# Altium schematic sheet obc-v2_MCU-POWER.SchDoc
size 420 x 297 mm; SheetNumber: 22; SheetTotal: 23
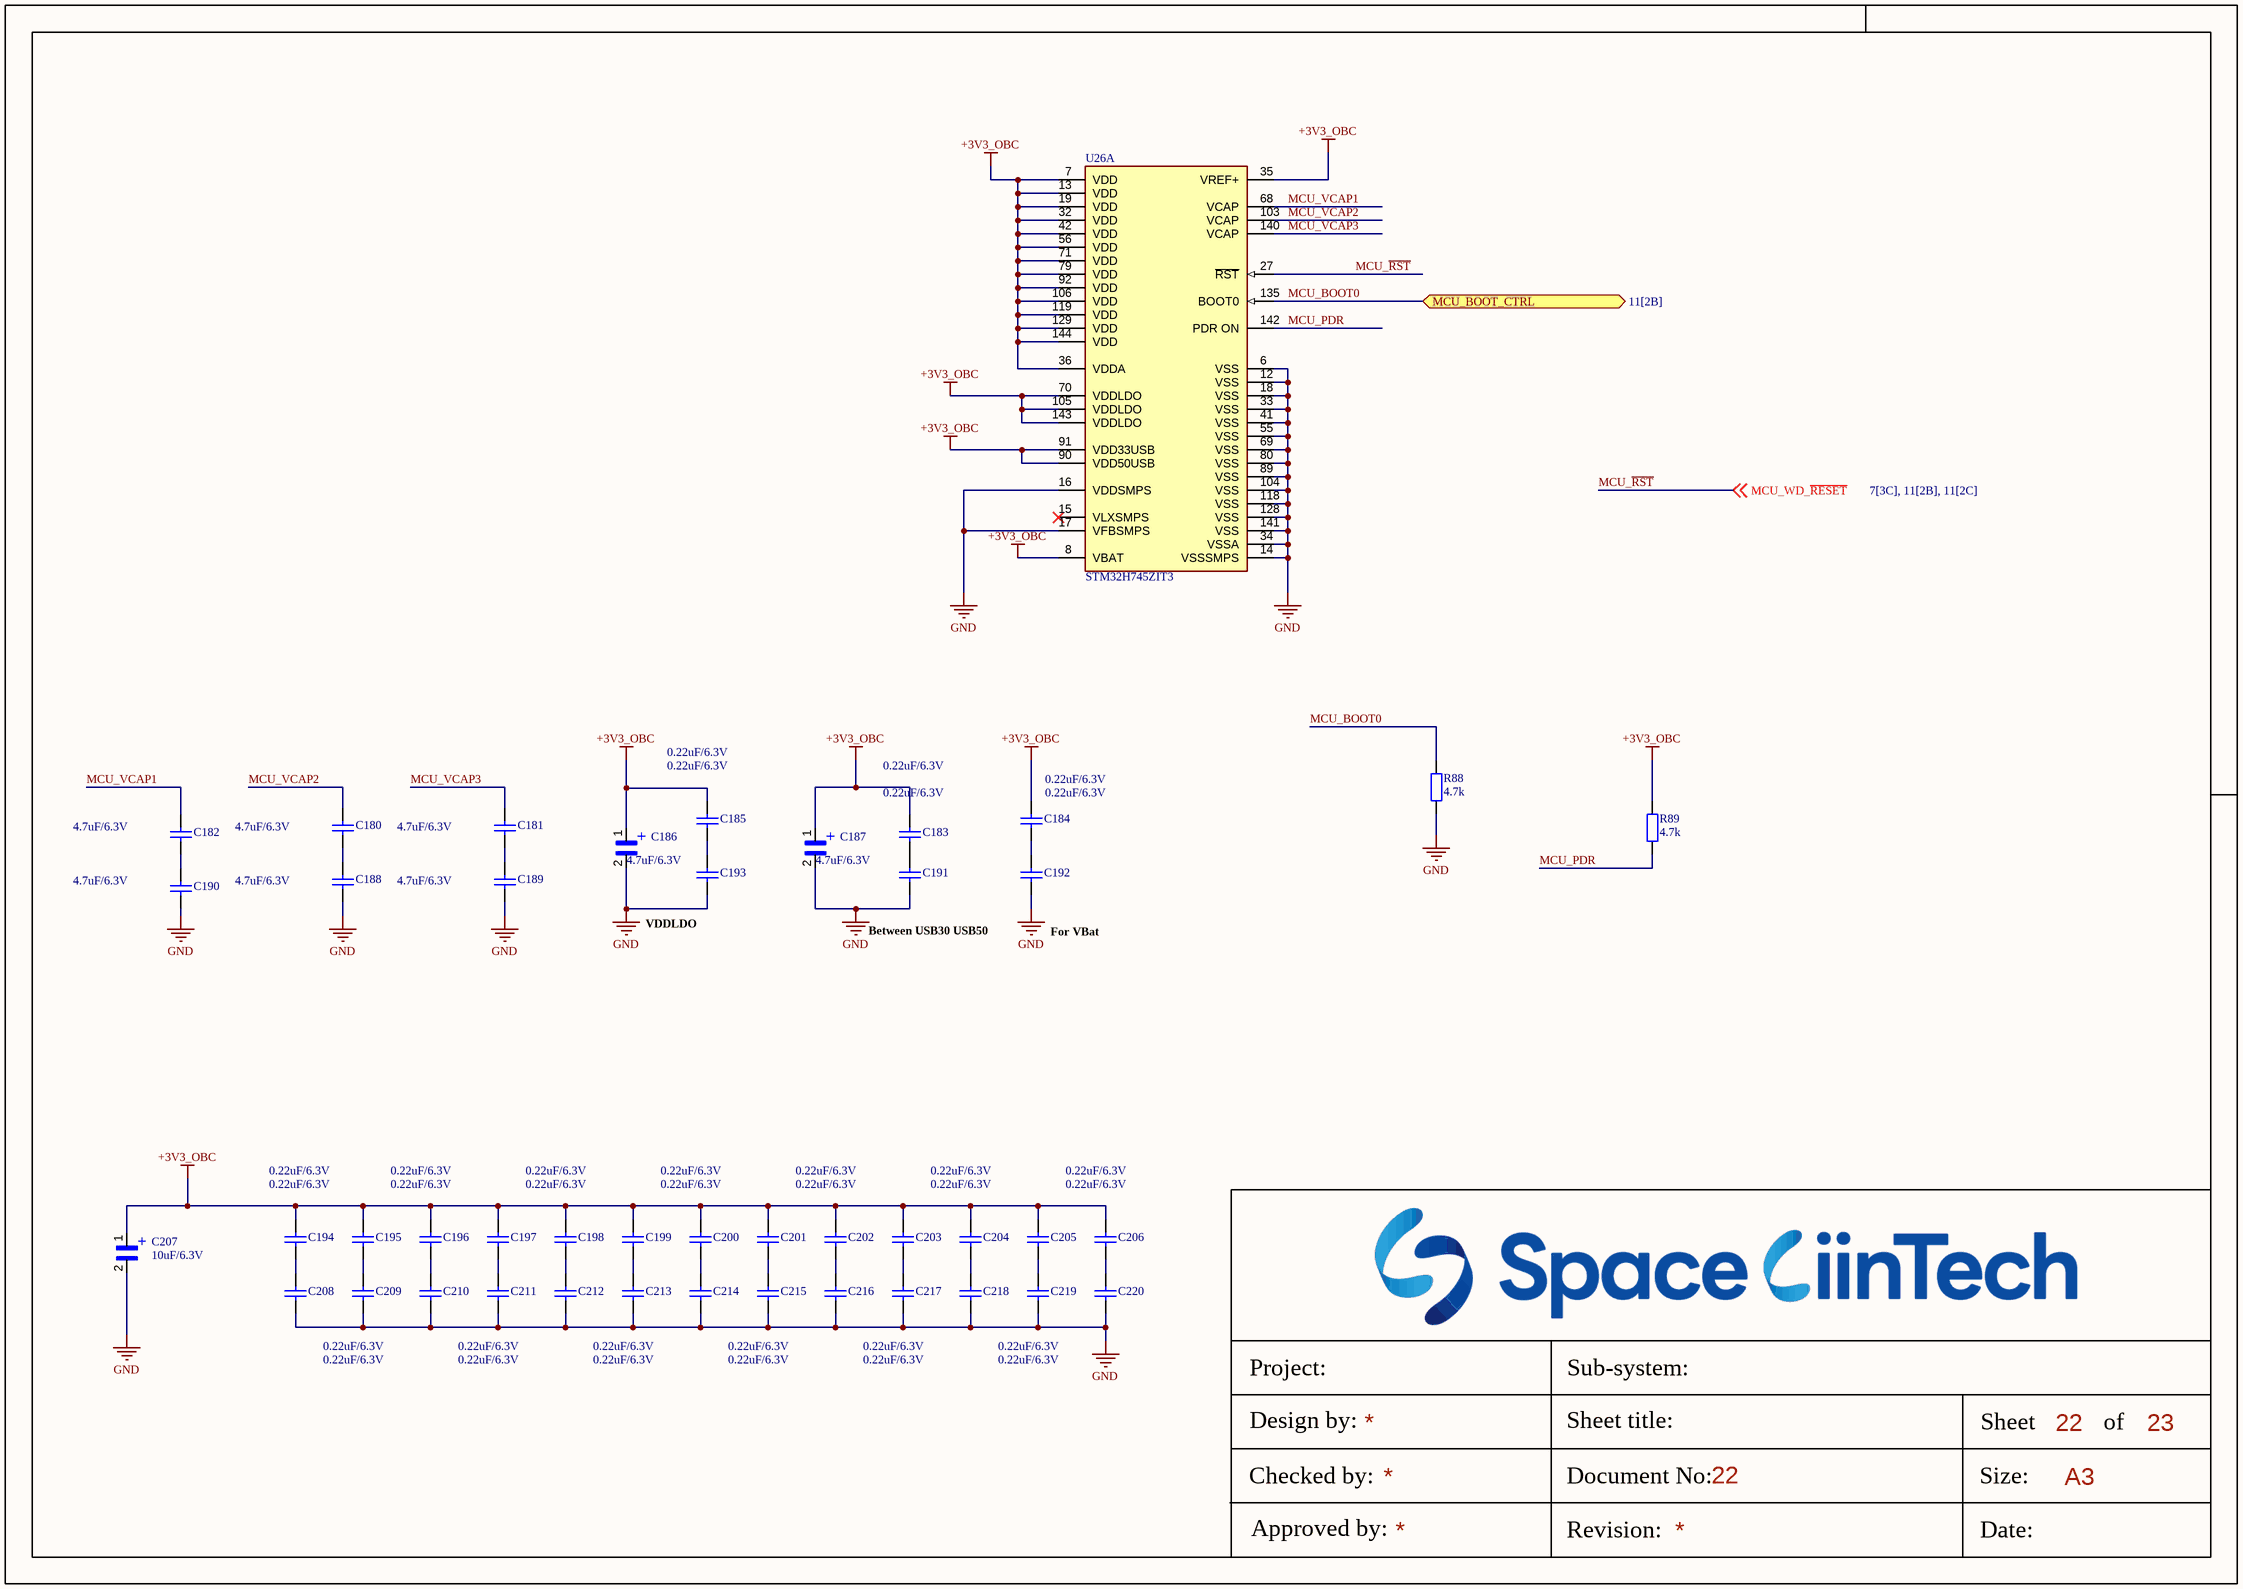
[diagram p0: obc-v2_MCU-POWER.SchDoc]

## Parts
C180  4.7uF/6.3V  [CAP_C_1005X60]
C181  4.7uF/6.3V  [CAP_C_1005X60]
C182  4.7uF/6.3V  [CAP_C_1005X60]
C183  0.22uF/6.3V  [CAP_C_1005X60]
C184  0.22uF/6.3V  [CAP_C_1005X60]
C185  0.22uF/6.3V  [CAP_C_1005X60]
C186  4.7uF/6.3V  [CAP_MP_1608X90]
C187  4.7uF/6.3V  [CAP_MP_1608X90]
C188  4.7uF/6.3V  [CAP_C_1005X60]
C189  4.7uF/6.3V  [CAP_C_1005X60]
C190  4.7uF/6.3V  [CAP_C_1005X60]
C191  0.22uF/6.3V  [CAP_C_1005X60]
C192  0.22uF/6.3V  [CAP_C_1005X60]
C193  0.22uF/6.3V  [CAP_C_1005X60]
C194  0.22uF/6.3V  [CAP_C_1005X60]
C195  0.22uF/6.3V  [CAP_C_1005X60]
C196  0.22uF/6.3V  [CAP_C_1005X60]
C197  0.22uF/6.3V  [CAP_C_1005X60]
C198  0.22uF/6.3V  [CAP_C_1005X60]
C199  0.22uF/6.3V  [CAP_C_1005X60]
C200  0.22uF/6.3V  [CAP_C_1005X60]
C201  0.22uF/6.3V  [CAP_C_1005X60]
C202  0.22uF/6.3V  [CAP_C_1005X60]
C203  0.22uF/6.3V  [CAP_C_1005X60]
C204  0.22uF/6.3V  [CAP_C_1005X60]
C205  0.22uF/6.3V  [CAP_C_1005X60]
C206  0.22uF/6.3V  [CAP_C_1005X60]
C207  10uF/6.3V  [CAP_MP_2012X170]
C208  0.22uF/6.3V  [CAP_C_1005X60]
C209  0.22uF/6.3V  [CAP_C_1005X60]
C210  0.22uF/6.3V  [CAP_C_1005X60]
C211  0.22uF/6.3V  [CAP_C_1005X60]
C212  0.22uF/6.3V  [CAP_C_1005X60]
C213  0.22uF/6.3V  [CAP_C_1005X60]
C214  0.22uF/6.3V  [CAP_C_1005X60]
C215  0.22uF/6.3V  [CAP_C_1005X60]
C216  0.22uF/6.3V  [CAP_C_1005X60]
C217  0.22uF/6.3V  [CAP_C_1005X60]
C218  0.22uF/6.3V  [CAP_C_1005X60]
C219  0.22uF/6.3V  [CAP_C_1005X60]
C220  0.22uF/6.3V  [CAP_C_1005X60]
R88  4.7k  [RES_C_1608X60]
R89  4.7k  [RES_C_1608X60]
U26  STM32H745ZIT3  [FP-LQFP144-1A-MFG]  (part A of 3)

## Ports
MCU_BOOT_CTRL (bidir, see 11[2B])

## Nets
+3V3_OBC: C183.1 C184.1 C185.1 C186.1 C187.1 C194.1 C195.1 C196.1 C197.1 C198.1 C199.1 C200.1 C201.1 C202.1 C203.1 C204.1 C205.1 C206.1 C207.1 R89.1 U26.7(VDD) U26.8(VBAT) U26.13(VDD) U26.19(VDD) U26.32(VDD) U26.35(VREF+) U26.36(VDDA) U26.42(VDD) U26.56(VDD) U26.70(VDDLDO) U26.71(VDD) U26.79(VDD) U26.90(VDD50USB) U26.91(VDD33USB) U26.92(VDD) U26.105(VDDLDO) U26.106(VDD) U26.119(VDD) U26.129(VDD) U26.143(VDDLDO) U26.144(VDD)
GND: C186.2 C187.2 C188.2 C189.2 C190.2 C191.2 C192.2 C193.2 C207.2 C208.2 C209.2 C210.2 C211.2 C212.2 C213.2 C214.2 C215.2 C216.2 C217.2 C218.2 C219.2 C220.2 R88.1 U26.6(VSS) U26.12(VSS) U26.14(VSSSMPS) U26.16(VDDSMPS) U26.17(VFBSMPS) U26.18(VSS) U26.33(VSS) U26.34(VSSA) U26.41(VSS) U26.55(VSS) U26.69(VSS) U26.80(VSS) U26.89(VSS) U26.104(VSS) U26.118(VSS) U26.128(VSS) U26.141(VSS)
MCU_BOOT0: R88.2 U26.135(BOOT0) ; port MCU_BOOT_CTRL
MCU_PDR: R89.2 U26.142(PDR_ON)
MCU_~{RST}: U26.27(~{RST}) ; off-sheet MCU_WD_~{RESET}  [also labelled MCU_WD_~{RESET}]
MCU_VCAP1: C182.1 U26.68(VCAP)
MCU_VCAP2: C180.1 U26.103(VCAP)
MCU_VCAP3: C181.1 U26.140(VCAP)
NetC180_2: C180.2 C188.1
NetC181_2: C181.2 C189.1
NetC182_2: C182.2 C190.1
NetC183_2: C183.2 C191.1
NetC184_2: C184.2 C192.1
NetC185_2: C185.2 C193.1
NetC194_2: C194.2 C208.1
NetC195_2: C195.2 C209.1
NetC196_2: C196.2 C210.1
NetC197_2: C197.2 C211.1
NetC198_2: C198.2 C212.1
NetC199_2: C199.2 C213.1
NetC200_2: C200.2 C214.1
NetC201_2: C201.2 C215.1
NetC202_2: C202.2 C216.1
NetC203_2: C203.2 C217.1
NetC204_2: C204.2 C218.1
NetC205_2: C205.2 C219.1
NetC206_2: C206.2 C220.1

Not connected (* = marked no-connect by the designer): U26 15(VLXSMPS)*

## Notes on the sheet
- VDDLDO
- Between USB30 USB50
- (near C192) For VBat
- Project:
- Sub-system:
- Design by:
- Sheet title:
- Sheet
- A3
- of
- Checked by:
- Approved by:
- Revision:
- Document No:
- Size:
- Date:
- (in symbol TACL335M003RTA) +
- (in symbol TACR686M003RTA) +

## Library data of the parts
C180-C182 C185 C188-C190 C193 = Tu 0402 33nF 10V: 4.7 µF ±20% 6.3V Ceramic Capacitor X7T 0402 (1005 Metric): GRT155D70J475ME13J; Chung_Loai: Dán; Don_Vi: Con; So_Chan: 2; Ten_Linh_Kien: Tụ 0402 33nF X7R 10V GRM155R71A333KA01D; Ma_Hang: MH007853; Kieu_Chan: *
C183 C184 C191 C192 C194-C206 C208-C220 = Tu 0402 33nF 10V: CAPC; Chung_Loai: Dán; Don_Vi: Con; So_Chan: 2; Ten_Linh_Kien: Tụ 0402 33nF X7R 10V GRM155R71A333KA01D; Ma_Hang: MH007853; Kieu_Chan: *
C186 C187 = TACL335M003RTA: CAPP; Package: None; Price: None; Value: *; MP: TACL335M003RTA; Availability: Unavailable
C207 = TACR686M003RTA: CAPP; MF: AVX; Availability: Unavailable; SnapEDA_Link: https://www.snapeda.com/parts/TACR686M003RTA/AVX/view-part/1745975/?ref=snap; MP: TACR686M003RTA; Value: *; Price: None; Package: 0805 AVX
R88 R89 = Tro 0603 1% 10k: RES; Chung_Loai: Dán; Don_Vi: Con; So_Chan: 2; Ten_Linh_Kien: Trở 0603 1% 10k; Ma_Hang: MH006333; Kieu_Chan: *
U26 = CMP-12105-000054-1: HIGH-PERFORMANCE AND DSP WITH DP; Manufacturer Part Number: STM32H745ZIT6; Manufacturer: STMicroelectronics; Number Of Timers/Counters: 20; Min Supply Voltage: 1.62V; Frequency: 480MHz; Number Of I2C Channels: 4; Memory Type: FLASH; Number Of I/Os: 97; Number Of Pwm Channels: 42; Number Of Usb Channels: 2; Ram Size: 1MBytes; Memory Size: 2MBytes; Data Bus Width: 32bits; Number Of Adc Channels: 23; Number Of Ethernet Channels: 1; Number Of Uart Channels: 9; Interface: I2C,SPI,UART,USART,CAN,USB,LIN,IrDA,Ethernet,I2S,Other; Number Of A/D Converters: 3; Max Junction Temp: +125°C; Max Supply Voltage: 3.6V; Core Architecture: ARM Cortex-M4, Cortex-M7; Number Of Spi Channels: 6; Standoff Height: 0.05mm; Ambient Temperature Range Low: -40°C; Lead Free: Yes; Automotive: No; Height: 1.6mm; Device Class L1: Integrated Circuits (ICs); Ambient Temperature Range High: +85°C; RoHS: TRUE; Temperature Range High: +125°C; Temperature: -40°C to +125°C; Category: IC; Device Class L2: Embedded Processors and Controllers; Number Of Cores: 2; Temperature Range Low: -40°C; Octopart: https://octopart.com/stm32h745zit6-stmicroelectronics-100293939; Digikey Description: HIGH-PERFORMANCE AND DSP WITH DP; Package: LQFP144-1A; Device Class L3: Microcontrollers; ComponentLink2URL: https://www.st.com/resource/en/datasheet/stm32h745zi.pdf; ComponentLink2Description: Datasheet